# EasyEDA schematic imu_立创EDA.json
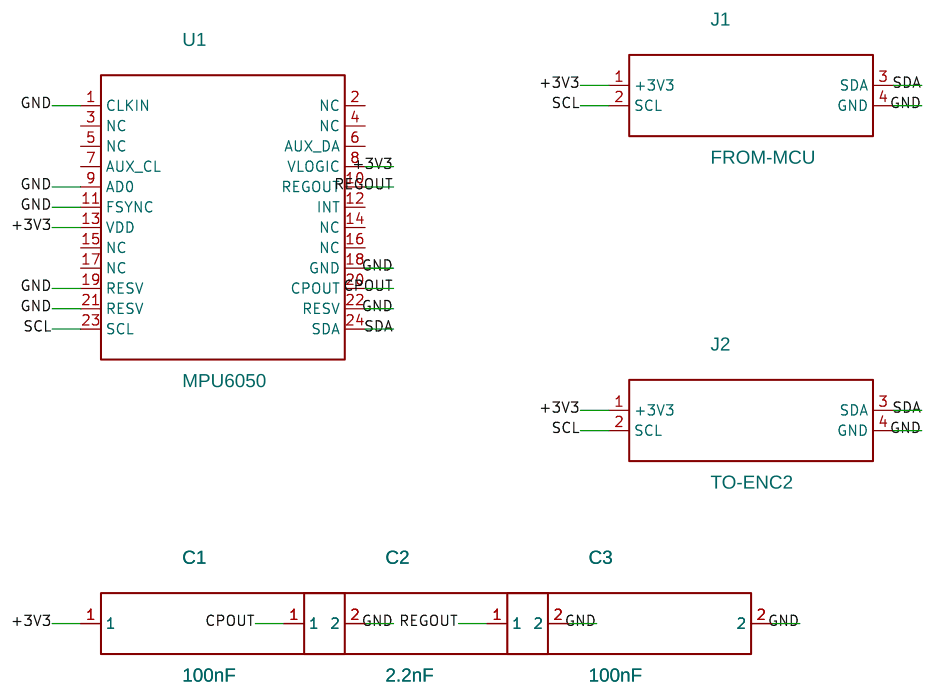
[diagram p0: schematic sheet]

## Parts
C1  100nF  [C0805]
C2  2.2nF  [C0805]
C3  100nF  [C0805]
J1  FROM-MCU  [GH1.25_4P]
J2  TO-ENC2  [GH1.25_4P]
U1  MPU6050  [QFN-24_L4.0-W4.0-P0.50-BL-EP]

## Library data of the parts
C1-C3 J1 J2 U1 = -: : Contributor; LCEDA_Lib: spicePre; U: spiceSymbolName

## Nets
+3V3: C1.1 J1.1(+3V3) J2.1(+3V3) U1.8(VLOGIC) U1.13(VDD)
GND: C1.2 C2.2 C3.2 J1.4(GND) J2.4(GND) U1.1(CLKIN) U1.9(AD0) U1.11(FSYNC) U1.18(GND) U1.19(RESV) U1.21(RESV) U1.22(RESV)
CPOUT: C2.1 U1.20(CPOUT)
REGOUT: C3.1 U1.10(REGOUT)
SCL: J1.2(SCL) J2.2(SCL) U1.23(SCL)
SDA: J1.3(SDA) J2.3(SDA) U1.24(SDA)

Not connected (* = marked no-connect by the designer): U1 2(NC) 3(NC) 4(NC) 5(NC) 6(AUX_DA) 7(AUX_CL) 12(INT) 14(NC) 15(NC) 16(NC) 17(NC)
